# Altium schematic sheet 2_PowerPerif.SchDoc
size 414 x 293 mm; SheetNumber: 2; SheetTotal: 4
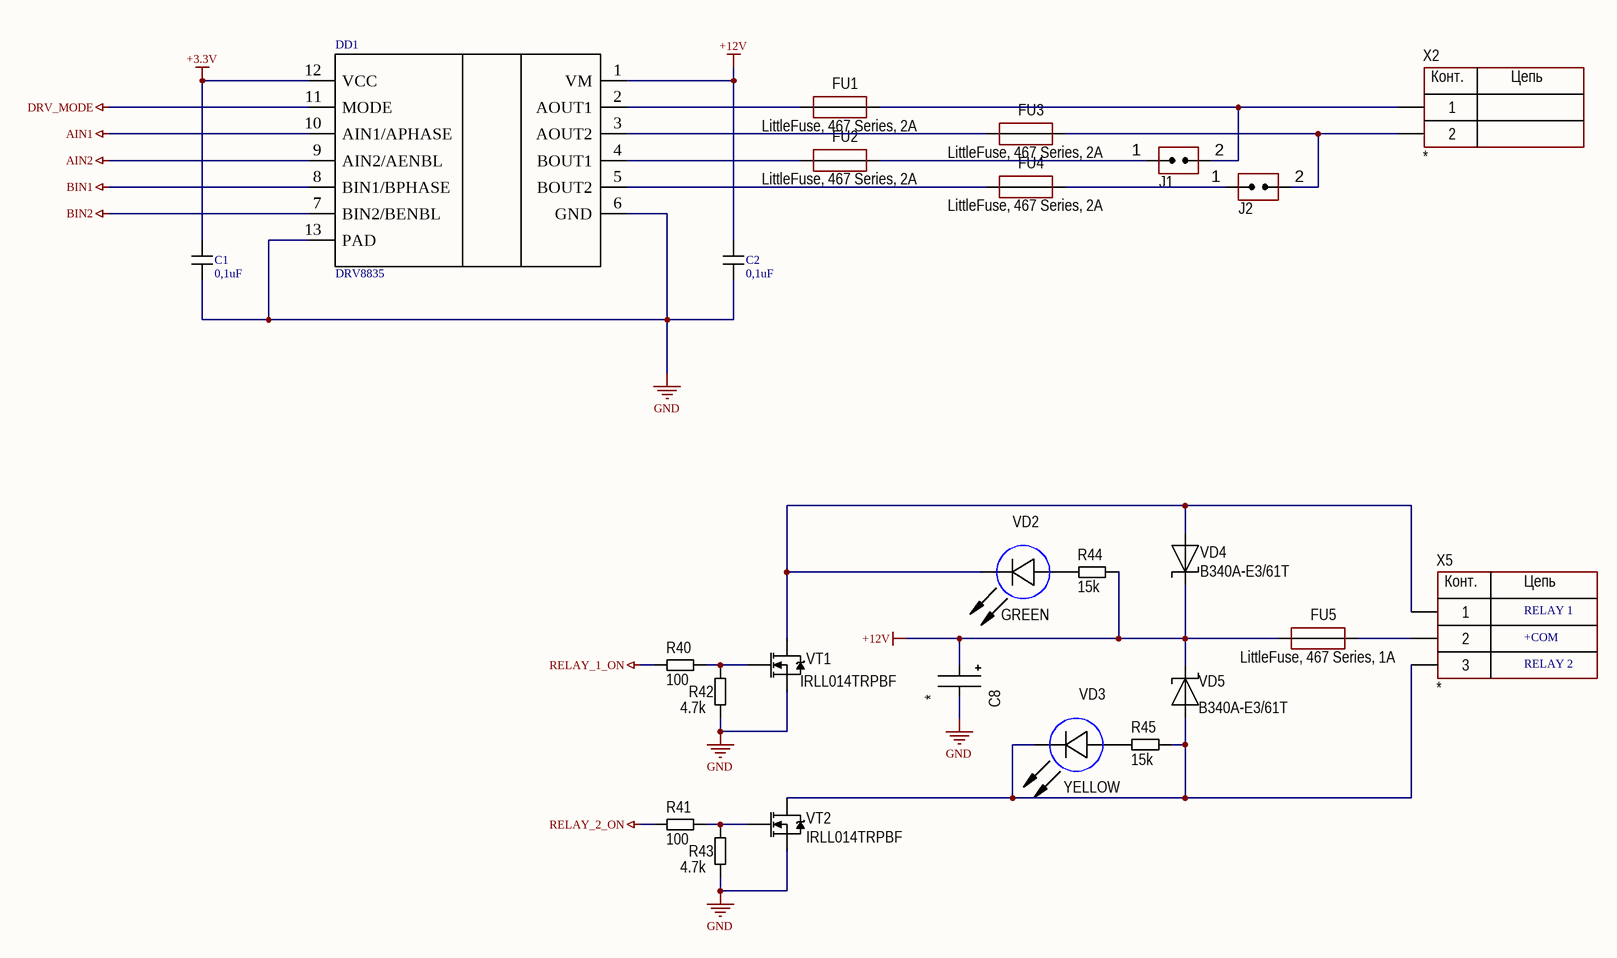
[diagram p0: 2_PowerPerif.SchDoc]

## Parts
C1  0,1uF  [C_0603]
C2  0,1uF  [C_0603]
C8  *  [D8C3.2H12]
DD1  DRV8835  [WSON12]
FU1  LittleFuse, 467 Series, 2A  [CH0603F]
FU2  LittleFuse, 467 Series, 2A  [CH0603F]
FU3  LittleFuse, 467 Series, 2A  [CH0603F]
FU4  LittleFuse, 467 Series, 2A  [CH0603F]
FU5  LittleFuse, 467 Series, 1A  [CH0603F]
J1  Jumper-2  [CON: PLS-2]  (value not drawn)
J2  Jumper-2  [CON: PLS-2]  (value not drawn)
R40  100  [CH0805R]
R41  100  [CH0805R]
R42  4.7k  [CH0805R]
R43  4.7k  [CH0805R]
R44  15k  [CH0805R]
R45  15k  [CH0805R]
VD2  GREEN  [CH0603LB]
VD3  YELLOW  [CH0603LB]
VD4  B340A-E3/61T  [SMA]
VD5  B340A-E3/61T  [SMA]
VT1  IRLL014TRPBF  [SOT223]
VT2  IRLL014TRPBF  [SOT223]
X2  *  [CON: CWF-2]
X5  *  [CON: 300-03P-5.0]

## Nets
+3.3V: C1.2 DD1.12(VCC)
+12V: C2.2 C8.1 DD1.1(VM) FU5.1 R44.2 VD4.2 VD5.2
AIN1: DD1.10(AIN1/APHASE)
AIN2: DD1.9(AIN2/AENBL)
BIN1: DD1.8(BIN1/BPHASE)
BIN2: DD1.7(BIN2/BENBL)
DRV_MODE: DD1.11(MODE)
GND: C1.1 C2.1 C8.2 DD1.6(GND) DD1.13(PAD) R42.1 R43.1 VT1.3(S) VT2.3(S)
RELAY_1_ON: R40.2
RELAY_2_ON: R41.2
NetDD1_2: DD1.2(AOUT1) FU1.1
NetDD1_3: DD1.3(AOUT2) FU3.1
NetDD1_4: DD1.4(BOUT1) FU2.1
NetDD1_5: DD1.5(BOUT2) FU4.1
NetFU1_2: FU1.2 J1.2(IN) X2.1
NetFU2_2: FU2.2 J1.1(IN)
NetFU3_2: FU3.2 J2.2(IN) X2.2
NetFU4_2: FU4.2 J2.1(IN)
NetFU5_2: FU5.2 X5.2
NetR40_1: R40.1 R42.2 VT1.1(G)
NetR41_1: R41.1 R43.2 VT2.1(G)
NetR44_1: R44.1 VD2.1(A)
NetR45_1: R45.1 VD3.1(A)
NetR45_2: R45.2 VD3.2(C) VD5.1 VT2.2(D) X5.3
NetVD2_2: VD2.2(C) VD4.1 VT1.2(D) X5.1

## Notes on the sheet
- RELAY 1
- +COM
- RELAY 2
- Лист
- Изм.
- № докум.
- Подпись
- Дата
- (in symbol 2-Connector) Конт.; Цепь
- (in symbol 3-Connector) Конт.; Цепь

## Library data of the parts
C1 C2 = C_SMD
C8 = AlumCap: Manufacturer: *; Model: *; HelpURL: *; ComponentKind: *; Value: *
DD1 = DRV8835: Driver
FU1-FU5 = Fuse: Manufacturer: *; Model: *; HelpURL: *; ComponentKind: *; Value: *
J1 J2 = Jumper-2: Jumper; Manufacturer: China; Model: PLS-2
R40-R45 = Resistor: Manufacturer: *; Model: *; HelpURL: *; ComponentKind: *; Value: *
VD2 VD3 = LED_1: Manufacturer: *; Model: *; HelpURL: *; ComponentKind: *; Value: *
VD4 VD5 = Diod Schottky: ComponentKind: *; Manufacturer: *; Model: *; HelpURL: *
VT1 VT2 = N-chanel: Mosfet; Model: *; Manufacturer: *; ComponentKind: *; HelpURL: *
X2 = 2-Connector: Model: *; Manufacturer: *; HelpURL: *; ComponentKind: *
X5 = 3-Connector: Model: *; Manufacturer: *; HelpURL: *; ComponentKind: *